# Altium schematic sheet 001_OverView.SchDoc: OverView BAS Base Grid
size A2; Date: 2021/11/23; Organization: Greenfield Tech Solutions; Address1: Molendreef 33; Address2: Ossendrecht; Address3: 4641CS; Address4: The Netherlands; SheetNumber: 1; SheetTotal: 3
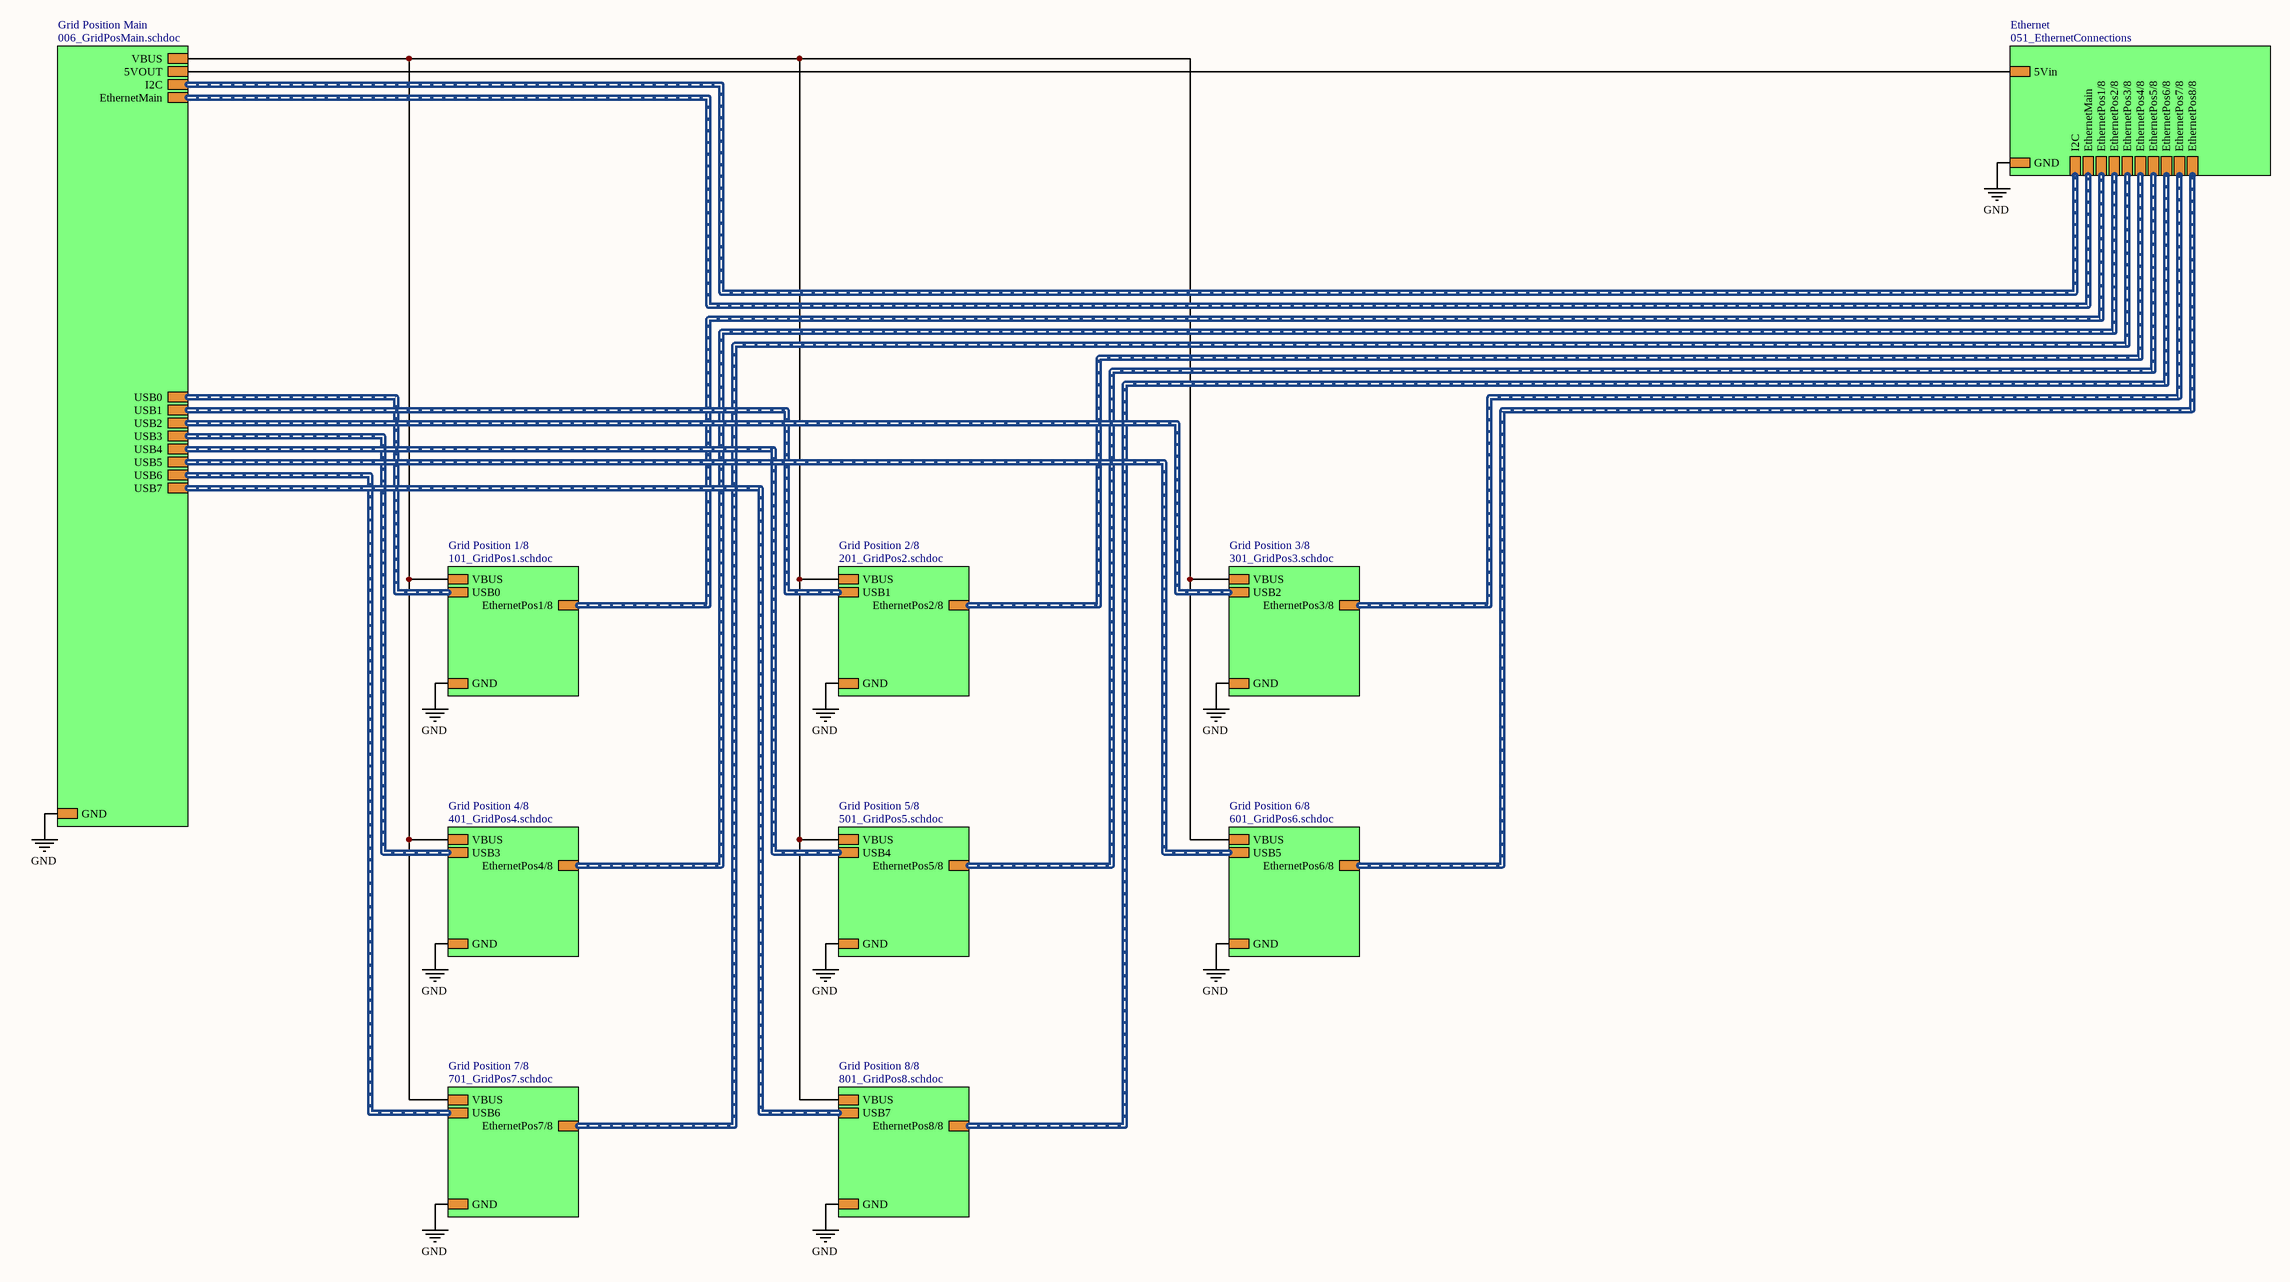
[diagram p0: 001_OverView.SchDoc]

## Sub-sheets
Ethernet = 051_EthernetConnections: GND, 5Vin, EthernetMain, EthernetPos1/8, EthernetPos2/8, EthernetPos3/8, EthernetPos4/8, EthernetPos5/8, EthernetPos6/8, EthernetPos7/8, EthernetPos8/8, I2C
Grid Position 1/8 = 101_GridPos1.schdoc: GND, EthernetPos1/8, VBUS, USB0
Grid Position 2/8 = 201_GridPos2.schdoc: GND, USB1, EthernetPos2/8, VBUS
Grid Position 3/8 = 301_GridPos3.schdoc: GND, USB2, EthernetPos3/8, VBUS
Grid Position 4/8 = 401_GridPos4.schdoc: GND, USB3, EthernetPos4/8, VBUS
Grid Position 5/8 = 501_GridPos5.schdoc: GND, USB4, EthernetPos5/8, VBUS
Grid Position 6/8 = 601_GridPos6.schdoc: GND, USB5, EthernetPos6/8, VBUS
Grid Position 7/8 = 701_GridPos7.schdoc: GND, USB6, EthernetPos7/8, VBUS
Grid Position 8/8 = 801_GridPos8.schdoc: GND, USB7, EthernetPos8/8, VBUS
Grid Position Main = 006_GridPosMain.schdoc: GND, 5VOUT, EthernetMain, I2C, VBUS, USB0, USB1, USB2, USB3, USB4, USB5, USB6, USB7

## Nets
GND: sheet Grid Position 1/8/GND, sheet Grid Position 2/8/GND, sheet Grid Position 4/8/GND, sheet Grid Position 5/8/GND, sheet Grid Position 3/8/GND, sheet Grid Position 6/8/GND, sheet Grid Position 7/8/GND, sheet Grid Position Main/GND, sheet Grid Position 8/8/GND, sheet Ethernet/GND
(unnamed): sheet Grid Position 1/8/VBUS, sheet Grid Position 2/8/VBUS, sheet Grid Position 4/8/VBUS, sheet Grid Position 5/8/VBUS, sheet Grid Position 3/8/VBUS, sheet Grid Position 6/8/VBUS, sheet Grid Position 7/8/VBUS, sheet Grid Position Main/VBUS, sheet Grid Position 8/8/VBUS
(unnamed): sheet Grid Position Main/5VOUT, sheet Ethernet/5Vin

## Buses and harness runs
harness sheet Ethernet/EthernetMain = sheet Grid Position Main/EthernetMain
harness sheet Ethernet/EthernetPos1/8 = sheet Grid Position 1/8/EthernetPos1/8
harness sheet Ethernet/EthernetPos2/8 = sheet Grid Position 4/8/EthernetPos4/8
harness sheet Ethernet/EthernetPos3/8 = sheet Grid Position 7/8/EthernetPos7/8
harness sheet Ethernet/EthernetPos4/8 = sheet Grid Position 2/8/EthernetPos2/8
harness sheet Ethernet/EthernetPos5/8 = sheet Grid Position 5/8/EthernetPos5/8
harness sheet Ethernet/EthernetPos6/8 = sheet Grid Position 8/8/EthernetPos8/8
harness sheet Ethernet/EthernetPos7/8 = sheet Grid Position 3/8/EthernetPos3/8
harness sheet Ethernet/EthernetPos8/8 = sheet Grid Position 6/8/EthernetPos6/8
harness sheet Ethernet/I2C = sheet Grid Position Main/I2C
harness sheet Grid Position 1/8/USB0 = sheet Grid Position Main/USB0
harness sheet Grid Position 2/8/USB1 = sheet Grid Position Main/USB1
harness sheet Grid Position 3/8/USB2 = sheet Grid Position Main/USB2
harness sheet Grid Position 4/8/USB3 = sheet Grid Position Main/USB3
harness sheet Grid Position 5/8/USB4 = sheet Grid Position Main/USB4
harness sheet Grid Position 6/8/USB5 = sheet Grid Position Main/USB5
harness sheet Grid Position 7/8/USB6 = sheet Grid Position Main/USB6
harness sheet Grid Position 8/8/USB7 = sheet Grid Position Main/USB7

## Notes on the sheet
- Title
- Size:
- Date:
- File:
- A2
- Number:
- Time:
- Revision:
- Sheet
- of